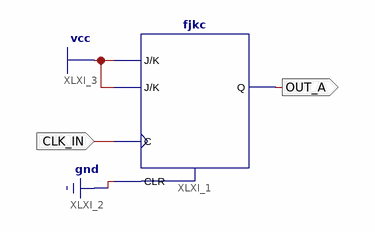
[diagram p0: schematic sheet 1]
// Xilinx ISE schematic mod2.sch (spartan6) as structural Verilog: 1 symbols, 2 ports
module mod2 (
  input  CLK_IN,
  output OUT_A
);

  fjkc XLXI_1 (.C(CLK_IN), .CLR(1'b0), .J(1'b1), .K(1'b1), .Q(OUT_A));
endmodule
